# EAGLE design headstageNano16LVDS-V1_6 (EAGLE 8.3.2)
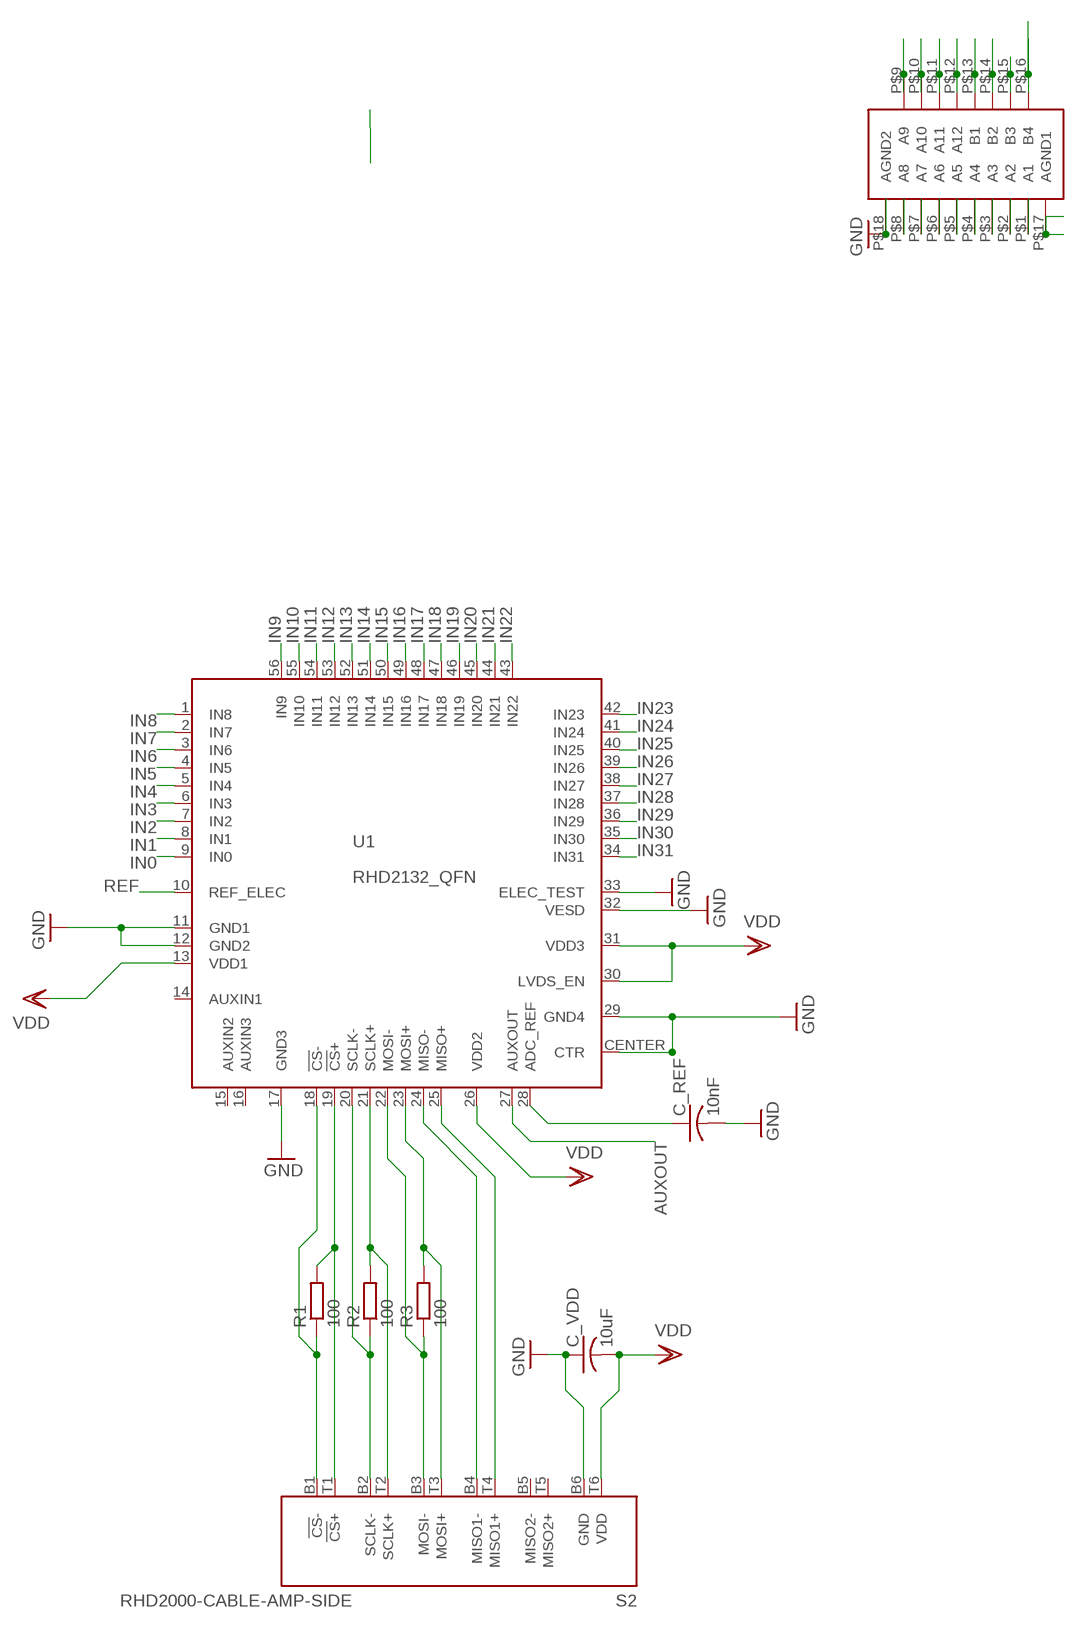
[diagram p0: schematic, sheet 1]

## Parts
C_REF  10nF  C-USC0402K  [C0402K]
C_VDD  10uF  C-USC0402K  [C0402K]
R1  100  R-EU_R0402  [R0402]
R2  100  R-EU_R0402  [R0402]
R3  100  R-EU_R0402  [R0402]
S2  RHD2000-CABLE-AMP-SIDE  [OMNETICS_PZN-12-AA]
U1  RHD2132_QFN  [QFN56_8_X_8_LARGE]
U$1  OMNETICS_FE18  [OMNETICS_FE18]

## Nets
ADC_REF: C_REF.1 U1.28(ADC_REF)
AGND1: U$1.P$17(AGND1)
AUXOUT: U1.27(AUXOUT)
CS+: R1.2 S2.T1(!CS!+) U1.19(!CS!+)
CS-: R1.1 S2.B1(!CS!-) U1.18(!CS!-)
GND: C_REF.2 C_VDD.1 S2.B6(GND) U1.11(GND1) U1.12(GND2) U1.17(GND3) U1.29(GND4) U1.32(VESD) U1.33(ELEC_TEST) U1.CENTER(CTR) U$1.P$18(AGND2)
IN0: U1.9(IN0)
IN1: U1.8(IN1)
IN2: U1.7(IN2)
IN3: U1.6(IN3)
IN4: U1.5(IN4)
IN5: U1.4(IN5)
IN6: U1.3(IN6)
IN7: U1.2(IN7)
IN8: U1.1(IN8)
IN9: U1.56(IN9)
IN10: U1.55(IN10)
IN11: U1.54(IN11)
IN12: U1.53(IN12)
IN13: U1.52(IN13)
IN14: U1.51(IN14)
IN15: U1.50(IN15)
IN16: U1.49(IN16)
IN17: U1.48(IN17)
IN18: U1.47(IN18)
IN19: U1.46(IN19)
IN20: U1.45(IN20)
IN21: U1.44(IN21)
IN22: U1.43(IN22)
IN23: U1.42(IN23)
IN24: U1.41(IN24)
IN25: U1.40(IN25)
IN26: U1.39(IN26)
IN27: U1.38(IN27)
IN28: U1.37(IN28)
IN29: U1.36(IN29)
IN30: U1.35(IN30)
IN31: U1.34(IN31)
IN32: U$1.P$14(B2)
IN34: U$1.P$16(B4)
IN35: U$1.P$2(A2)
IN36: U$1.P$15(B3)
IN37: U$1.P$3(A3)
IN38: U$1.P$12(A12)
IN39: U$1.P$13(B1)
IN40: U$1.P$5(A5)
IN41: U$1.P$4(A4)
IN42: U$1.P$6(A6)
IN43: U$1.P$7(A7)
IN44: U$1.P$10(A10)
IN45: U$1.P$8(A8)
IN46: U$1.P$9(A9)
IN47: U$1.P$1(A1)
IN48: U$1.P$11(A11)
MISO1+: S2.T4(MISO1+) U1.25(MISO+)
MISO1-: S2.B4(MISO1-) U1.24(MISO-)
MOSI+: R3.2 S2.T3(MOSI+) U1.23(MOSI+)
MOSI-: R3.1 S2.B3(MOSI-) U1.22(MOSI-)
REF: U1.10(REF_ELEC)
SCLK+: R2.2 S2.T2(SCLK+) U1.21(SCLK+)
SCLK-: R2.1 S2.B2(SCLK-) U1.20(SCLK-)
VDD: C_VDD.2 S2.T6(VDD) U1.13(VDD1) U1.26(VDD2) U1.30(LVDS_EN) U1.31(VDD3)
Unconnected: S2.B5(MISO2-) S2.T5(MISO2+) U1.14(AUXIN1) U1.15(AUXIN2) U1.16(AUXIN3)

## Library data of the parts
C_REF C_VDD = resistor:C-US: CAPACITOR, American symbol
R1-R3 = resistor:R-EU_: RESISTOR, European symbol
S2 = RHD2000:RHD2000-CABLE-AMP-SIDE
U1 = RHD2000:RHD2132
U$1 = connectorsbottom:OMNETICS_FE18

## Board
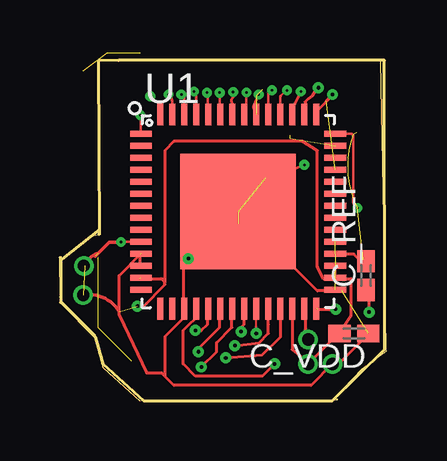
[diagram p1: board, top side]
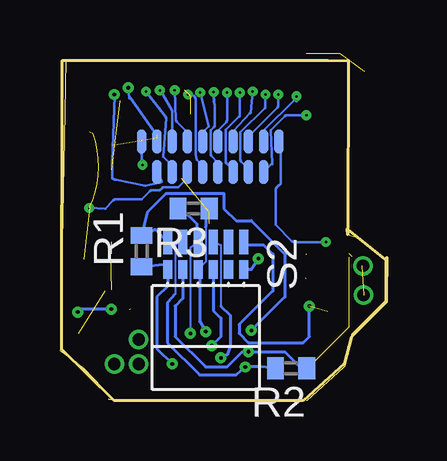
[diagram p2: board, bottom side, seen from below]

Size 13.61 x 14.19 mm. Coordinates in mm from the lower left corner, seen from the top.
Outline: 1.6,14.16 13.36,14.19 13.59,2.29 13.59,2.11 13.61,2.08 12.6,1.32 11.81,0.48 11.38,0.05 11.58,0.05 11.56,0.03 3.33,0 1.8,1.37 1.75,1.42 1.47,2.74 0.08,4.14 0.08,5.89
Outline: 1.63,6.91 1.22,6.81 0.36,6.12 0.25,6.07 0.08,5.89
Outline: 1.6,14.16 2.44,14.17 13.51,14.17 13.54,2.13 11.35,0 3.48,0 1.78,1.54 1.47,2.64 0.03,4.09 0.03,4.32 0,5.97 0.08,5.89
Outline: 1.6,14.16 1.63,6.91
Outline: 1.63,6.91 1.65,7.14 0.08,5.89
Copper layers (1*16): Top 0.0178mm / dielectric 59mil / Bottom 0.0178mm
Design rules "default": minimum track width 5mil, minimum drill 10mil, track to track 5mil, track to pad 5mil, pad to pad 5mil, via to via 5mil, smd to smd 5mil, copper to edge 10mil, drill to drill 16mil, minimum pad ring 6mil, minimum via ring 6mil, stop-mask expansion 3mil, vias tented up to drill 0mil, thermal gap 10mil

### Footprints (pad centres in the part's own frame; a part is rotated, then mirrored left to right if it is on the bottom)
C0402K = smd 0.925 x 0.74: 1 -0.6,0; 2 0.6,0
R0402 = smd 0.7 x 0.9: 1 -0.65,0; 2 0.65,0
OMNETICS_PZN-12-AA = smd 0.381 x 0.762: B1 1.587,-1.016; B2 0.953,-1.016; B3 0.318,-1.016; B4 -0.318,-1.016; B5 -0.953,-1.016; B6 -1.587,-1.016 | smd 0.381 x 1.016: T1 1.587,-2.159; T2 0.953,-2.159; T3 0.318,-2.159; T4 -0.318,-2.159; T5 -0.953,-2.159; T6 -1.587,-2.159
QFN56_8_X_8_LARGE = smd 0.9 x 0.25: 1 -4.05,3.25; 2 -4.05,2.75; 3 -4.05,2.25; 4 -4.05,1.75; 5 -4.05,1.25; 6 -4.05,0.75; 7 -4.05,0.25; 8 -4.05,-0.25; 9 -4.05,-0.75; 10 -4.05,-1.25; 11 -4.05,-1.75; 12 -4.05,-2.25; 13 -4.05,-2.75; 14 -4.05,-3.25; 29 4.05,-3.25; 30 4.05,-2.75; 31 4.05,-2.25; 32 4.05,-1.75; 33 4.05,-1.25; 34 4.05,-0.75; 35 4.05,-0.25; 36 4.05,0.25; 37 4.05,0.75; 38 4.05,1.25; 39 4.05,1.75; 40 4.05,2.25; 41 4.05,2.75; 42 4.05,3.25 | smd 0.25 x 0.9: 15 -3.25,-4.05; 16 -2.75,-4.05; 17 -2.25,-4.05; 18 -1.75,-4.05; 19 -1.25,-4.05; 20 -0.75,-4.05; 21 -0.25,-4.05; 22 0.25,-4.05; 23 0.75,-4.05; 24 1.25,-4.05; 25 1.75,-4.05; 26 2.25,-4.05; 27 2.75,-4.05; 28 3.25,-4.05; 43 3.25,4.05; 44 2.75,4.05; 45 2.25,4.05; 46 1.75,4.05; 47 1.25,4.05; 48 0.75,4.05; 49 0.25,4.05; 50 -0.25,4.05; 51 -0.75,4.05; 52 -1.25,4.05; 53 -1.75,4.05; 54 -2.25,4.05; 55 -2.75,4.05; 56 -3.25,4.05 | smd 4.8 x 4.8: CENTER 0,0
OMNETICS_FE18 = smd 0.381 x 1.016 bottom: P$1 -1.905,0.635; P$2 -1.27,0.635; P$3 -0.635,0.635; P$4 0,0.635; P$5 0.635,0.635; P$6 1.27,0.635; P$7 1.905,0.635; P$8 2.54,0.635; P$9 2.54,-0.635; P$10 1.905,-0.635; P$11 1.27,-0.635; P$12 0.635,-0.635; P$13 0,-0.635; P$14 -0.635,-0.635; P$15 -1.27,-0.635; P$16 -1.905,-0.635; P$17 -2.54,0.635; P$18 3.175,0.635

### Placement (x,y rotation side)
C_REF  12.75,5.21 90 top
C_VDD  12.24,2.79 180 top
R1  10.21,6.22 90 bottom
R2  3.99,1.35 180 bottom
R3  8.05,8 180 bottom
S2  7.54,4.45 180 bottom
U1  7.42,7.87 0 top
U$1  7.04,10.16 0 top

### Tracks (layer width: path | path; a pad name or v marks a point on that pad's centre or on a via)
ADC_REF  (via drill 0.15)  (1 unrouted)
  Top 0.127: C_REF.1 12.91,4.61 12.75,4.57 13,4.57 12.88,4.45 v12.88,3.68 | 10.72,4.06 10.72,3.81 v11.48,3.81
  Bottom 0.127: v11.48,3.81 12.75,3.81 v12.88,3.68
AUXOUT  (via drill 0.51)
  Top 0.127: v10.34,2.54 10.21,2.54 10.21,3.43 10.17,3.47 U1.27
CS+  (via drill 0.15)
  Top 0.127: v5.64,2.92 5.89,2.92 6.15,3.18 6.15,3.8 U1.19
  Bottom 0.127: v5.64,2.92 4.24,4.32 4.24,6.1 5.64,7.49 6.27,7.49 6.78,8 6.78,8.64 9.19,8.64 9.96,7.87 R1.2 9.65,7.13 S2.T1
CS-  (via drill 0.15)
  Top 0.127: v8.94,1.52 8.43,1.02 5.64,1.02 5.13,1.52 5.13,2.92 5.38,3.18 5.64,3.41 U1.18
  Bottom 0.076: 9.15,5.7 S2.B1
  Bottom 0.127: 9.19,5.4 S2.B1 9.13,4.76 9.58,4.32 9.58,2.16 v8.94,1.52 | R1.1 9.15,5.7
GND  (via drill 0.1, 0.15, 0.51)  (6 unrouted)
  Top 0.076: 11.61,1.52 12.75,2.67
  Top 0.102: v10.18,9.82 10.18,9.8 arc-45 10.27,9.84 9.45,9.53 8.87,9.53 arc45 8.78,9.49 8.56,9.27
  Top 0.127: 11.73,4.57 11.61,4.57 | 11.61,4.57 10.72,4.57 9.32,5.97 | 5.13,5.59 5.38,5.59 v5.35,5.91 | v5.35,5.91 5.89,6.1 5.64,6.1 7.42,7.37 | v5.35,5.91 5.26,5.71 | 5.26,5.71 5.13,5.59 | C_REF.2 12.53,5.81 12.24,6.1 11.49,6.1 | C_VDD.1 12.72,2.63 11.61,1.52 v11.35,1.52 10.46,0.63 4.75,0.63 4.37,1.02 | 4.37,1.02 4.24,1.14 3.61,1.14 2.46,3.56 2.46,5.21 3.35,6.1 3.35,5.62 U1.12 | 5.38,5.84 5.26,5.71 | 5.13,5.59 5.13,4.06 5.17,4.03 U1.17 5.17,3.46 4.37,2.67 4.37,1.02 | 11.49,6.1 11.48,6.1 | 11.49,6.1 U1.32 | U1.29 11.56,4.62 11.61,4.57
  Bottom 0.102: U$1.P$18 10.21,10.56 | 10.21,9.91 10.21,10.56 | 10.21,10.56 arc-45 10.25,10.65 v10.18,9.82
  Bottom 0.127: S2.B6 5.64,5.46 v5.35,5.91
IN8  (via drill 0.1)
  Top 0.102: U1.1 3.37,11.69 arc45 3.33,11.78 3.25,11.86 3.29,11.86 arc45 v3.35,11.89
  Bottom 0.102: v3.35,11.89 4.16,11.89 arc-45 4.25,11.85 4.83,11.25 4.77,9.86 arc45 4.81,9.84 5.13,9.53 5.16,9.53 5.18,9.5
IN9  (via drill 0.1)
  Top 0.102: U1.56 4.17,12.24 arc45 4.13,12.33 3.81,12.65 arc-45 v3.77,12.67 v3.76,12.67
  Top 0.127: U1.56 4.11,11.98 4.11,12.32
  Bottom 0.102: v3.76,12.67 3.76,12.47 arc45 3.82,12.56 5.18,11.2
IN10  (via drill 0.1)
  Top 0.102: U1.55 4.67,12.5 arc45 4.63,12.59 4.52,12.7 v4.52,12.75
  Bottom 0.102: v4.52,12.75 4.52,12.29 arc45 4.56,12.21 5.82,10.95
IN11  (via drill 0.1)
  Top 0.102: U1.54 5.17,12.64 arc45 5.13,12.73 5.08,12.78 v5.05,12.75
  Bottom 0.102: v5.05,12.75 5.05,12.27 arc45 5.09,12.18 6.1,11.18 6.1,10.03 arc-45 6.06,9.94 5.84,9.73
IN12  (via drill 0.1)
  Top 0.102: U1.53 5.67,12.68 arc45 5.64,12.75 5.64,12.77 arc45 5.6,12.86 v5.59,12.88
  Bottom 0.102: v5.59,12.88 5.66,11.99 arc45 5.7,11.98 6.4,11.23
IN13  (via drill 0.1)
  Top 0.102: v6.12,12.83 arc-45 6.15,12.77 6.15,12.07
  Top 0.127: U1.52 6.15,12.07
  Bottom 0.102: v6.12,12.83 6.12,11.91 arc45 6.16,11.83 6.71,11.28 6.71,9.96 arc-45 6.67,9.87 6.43,9.63
IN14  (via drill 0.1)
  Top 0.102: 6.65,11.94 v6.65,12.83
  Top 0.127: U1.51 6.65,11.94
  Bottom 0.102: v6.65,12.83 6.65,11.69 arc45 6.69,11.6 7.06,11.23
IN15  (via drill 0.1)
  Top 0.102: U1.50 7.17,12.39 arc45 7.13,12.48 7.14,12.52 7.19,12.61 arc45 v7.21,12.85
  Bottom 0.102: v7.21,12.85 7.21,12.6 arc45 7.2,12.46 7.16,12.32 7.16,11.48 arc45 7.2,11.39 7.34,11.25 7.34,10.29 arc-45 7.3,10.2 7.04,9.91 7.04,9.78
IN17  (2 unrouted)
  Top 0.127: 8.18,11.94 U1.48
IN18  (via drill 0.1)
  Top 0.102: U1.47 8.67,12.75 arc-45 8.7,12.84 8.81,12.95 v8.84,12.93
  Top 0.127: 8.69,11.94 U1.47
  Bottom 0.102: v8.84,12.93 8.79,11.71 arc-45 8.75,11.62 8.18,11.05
IN19  (via drill 0.1)
  Top 0.102: U1.46 9.17,12.61 arc-45 9.2,12.7 v9.45,12.93
  Bottom 0.102: v9.45,12.93 9.38,12.86 arc-45 9.34,12.77 8.94,12.06 8.94,11.23 arc45 8.98,11.14 9.07,11.05
IN21
  Top 0.127: U1.44 10.17,12.15 10.21,12.19 10.21,12.45 10.34,12.57 10.52,12.7 10.72,13.03 10.72,13.02
IN22
  Top 0.127: U1.43 10.67,12.27 10.72,12.06 11.43,12.78 11.39,12.69
IN23  (1 unrouted)
  Top 0.102: 12.62,5.9 arc45 12.66,5.81 12.88,5.59 | U1.42 12.09,11.12 arc-45 12.18,11.09 12.22,11.05 12.22,8.28 arc45 12.25,8.19 12.37,8.08
  Top 0.127: U1.42 11.28,11.12 11.23,11.18
IN24  (via drill 0.15)  (2 unrouted)
  Top 0.127: 10.85,13.08 v10.77,13.03
  Bottom 0.102: v10.77,13.03 10.72,12.6 arc-45 10.73,12.69 9.58,11.05 9.58,10.79
IN26  (via drill 0.15)  (1 unrouted)
  Top 0.127: v11.35,12.75 11.1,12.5
IN38  (via drill 0.1)
  Top 0.102: v8.28,12.76 8.05,12.24 arc45 8.09,12.15 8.18,12.06
  Bottom 0.102: U$1.P$12 7.67,9.73 arc-45 7.71,9.82 7.92,10.03 7.97,10.24 7.97,12.56 arc-45 8.01,12.65 8.05,12.7 v8.28,12.76
IN40  (via drill 0.1)
  Top 0.102: v7.77,12.83 7.75,12.22 arc45 7.63,12.23 7.67,12.06
  Bottom 0.102: U$1.P$5 7.67,11.12 arc45 7.63,11.21 7.42,11.43 v7.77,12.83
IN44  (via drill 0.1)
  Top 0.102: v10.03,12.88 10.08,12.83 arc-45 10.05,12.89 9.7,12.19
  Bottom 0.102: U$1.P$10 8.94,9.73 arc-45 8.98,9.82 9.32,10.16 9.19,11.76 arc-45 9.23,11.85 v10.03,12.88
IN46
  Bottom 0.102: U$1.P$9 9.59,9.55 9.38,9.12 arc45 9.47,9.08 10.06,8.96 11.28,9.19 arc45 11.44,9.28 11.43,9.96 11.33,12.72 arc45 11.37,12.74 11.33,12.75
IN48  (via drill 0.1)  (2 unrouted)
  Top 0.102: v12.39,8.03 v12.4,8.03
  Bottom 0.102: U$1.P$11 8.31,9.32 arc45 8.34,9.23 8.69,8.89 9.27,8.89 arc-45 9.36,8.85 9.45,8.76 9.78,8.76 arc-45 9.87,8.73 10.21,8.38 11.3,8.38 arc-45 11.39,8.35 11.73,8 v12.39,8.03
MISO1+  (via drill 0.15)
  Top 0.076: 9.19,3.43 U1.25
  Top 0.127: v6.91,1.78 8.42,1.9 9.19,2.65 9.19,3.43
  Bottom 0.076: S2.T4 7.16,6.6 6.91,6.48 6.91,3.94
  Bottom 0.127: 6.91,3.94 6.53,3.56 6.53,2.29 6.65,1.9 v6.91,1.78
MISO1-  (via drill 0.15)
  Top 0.127: v7.29,2.29 8.31,2.41 8.69,2.79 8.69,3.18 U1.24
  Bottom 0.127: S2.B4 7.23,3.75 6.91,3.43 6.91,2.67 v7.29,2.29
MOSI+  (via drill 0.15)
  Top 0.076: v8.18,2.79 8.18,3.68
  Top 0.127: 8.18,3.68 8.18,3.81 U1.23
  Bottom 0.076: 7.8,6.48 8.05,6.48 8.18,6.35 v8.18,2.79 | 7.92,6.67 S2.T3
  Bottom 0.127: S2.T3 7.8,6.48 | R3.2 8.56,8 7.92,7.37 7.92,6.67
MOSI-  (via drill 0.15)
  Top 0.076: 7.67,3.76 7.67,3.68
  Top 0.127: v7.54,2.87 7.54,3.05 7.67,3.18 7.67,3.76 U1.22
  Bottom 0.076: R3.1 7.53,7.89 | 7.54,7.24 7.54,5.78 S2.B3
  Bottom 0.127: S2.B3 7.92,5.4 7.8,5.4 7.8,3.3 v7.54,2.87 | 7.53,7.89 7.54,7.24
N$1  (2 unrouted)
N$2  (2 unrouted)
REF  (via drill 0.1)  (1 unrouted)
  Top 0.102: U1.10 2.46,6.62 arc45 2.41,6.6 v2.54,6.6
  Top 0.152: v2.54,6.6 2.06,6.6 1.46,6.01 | 1.59,6.13 arc60 1.07,5.61
  Bottom 0.102: v2.54,6.6 3.86,6.6 arc45 3.95,6.64 4.62,7.31 4.62,8.79 arc45 4.59,8.88 4.42,9.04 4.42,10.67 arc-45 4.46,10.76 4.6,10.9
SCLK+  (via drill 0.15)
  Top 0.076: 7.16,3.43 U1.21
  Top 0.127: v5.89,1.4 6.53,2.03 6.53,2.41 7.16,3.05 7.16,3.43
  Bottom 0.076: S2.T2 8.69,6.6 8.81,6.48 8.81,4.45
  Bottom 0.127: 8.81,4.45 9.14,4.06 9.14,2.41 7.8,1.07 6.27,1.07 v5.89,1.4 5.26,1.4 R2.2
SCLK-  (via drill 0.15)
  Top 0.127: v5.77,2.03 5.77,2.16 6.65,3.05 6.65,3.68 6.67,3.7 U1.20
  Bottom 0.127: S2.B2 8.5,4.25 8.81,3.94 8.81,2.67 7.54,1.4 6.65,1.4 6.02,2.03 v5.77,2.03 4.24,2.03 3.56,1.35 R2.1
VDD  (via drill 0.15, 0.51)  (3 unrouted)
  Top 0.127: 3.35,5.08 4.22,5.08 | v3.23,3.94 3.48,3.94 4.37,4.83 4.37,4.93 | U1.26 9.67,2.12 10.08,1.78 v10.34,1.52 11.61,2.79 C_VDD.2 12.12,3.52 12.12,5.08 11.42,5.08 | 11.42,5.08 10.97,5.08 10.72,5.59 10.72,10.41 10.08,10.79 4.75,10.79 4.37,10.41 4.37,5.08 | 11.42,5.08 U1.30 U1.31 | 4.37,5.08 4.37,4.93 | 4.37,4.93 4.22,5.08 | 4.22,5.08 4.37,5.08
  Top 0.152: 1.25,5.82 1.04,5.61 v0.99,5.61 1.24,5.83 | v0.96,4.39 arc-68 2.46,3.71
  Bottom 0.076: 5.96,7.05 5.96,6.67
  Bottom 0.127: 5.96,7.05 S2.T6 5.83,6.48 5.13,6.48 4.75,6.1 4.75,4.57 6.15,3.18 6.15,2.79 5.77,2.41 3.48,2.41 3.23,2.67 v3.23,3.94